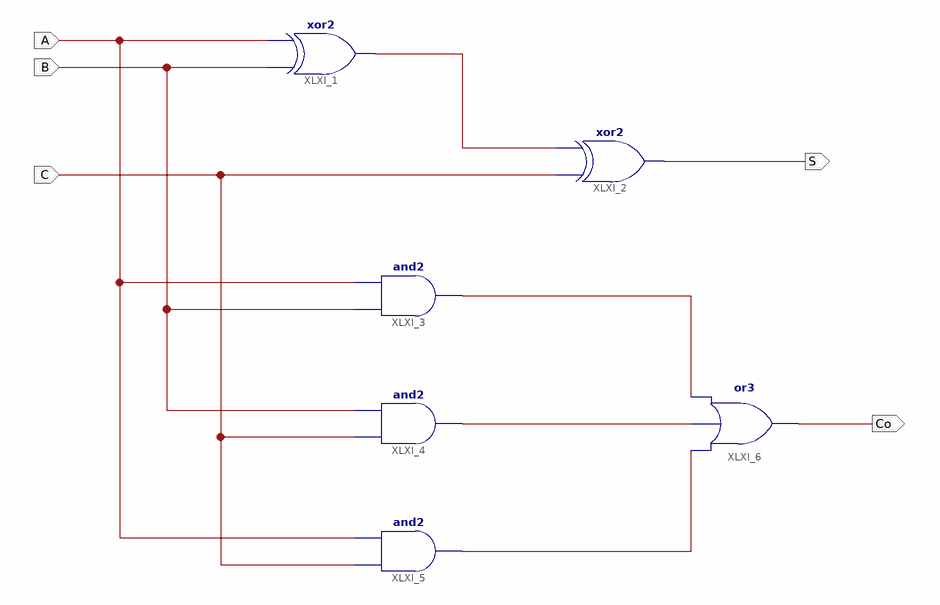
[diagram p0: schematic sheet 1]
// Xilinx ISE schematic Adder1b.sch (kintex7) as structural Verilog: 6 symbols, 5 ports
module Adder1b (
  input  A,
  input  B,
  input  C,
  output S,
  output Co
);

  wire XLXN_2, XLXN_12, XLXN_13, XLXN_14;

  xor XLXI_1 (XLXN_2, B, A);
  xor XLXI_2 (S, C, XLXN_2);
  and XLXI_3 (XLXN_12, B, A);
  and XLXI_4 (XLXN_13, C, B);
  and XLXI_5 (XLXN_14, C, A);
  or XLXI_6 (Co, XLXN_14, XLXN_13, XLXN_12);
endmodule
